# Altium schematic sheet analog.SchDoc
size 381 x 241 mm; SheetNumber: 8; SheetTotal: 13
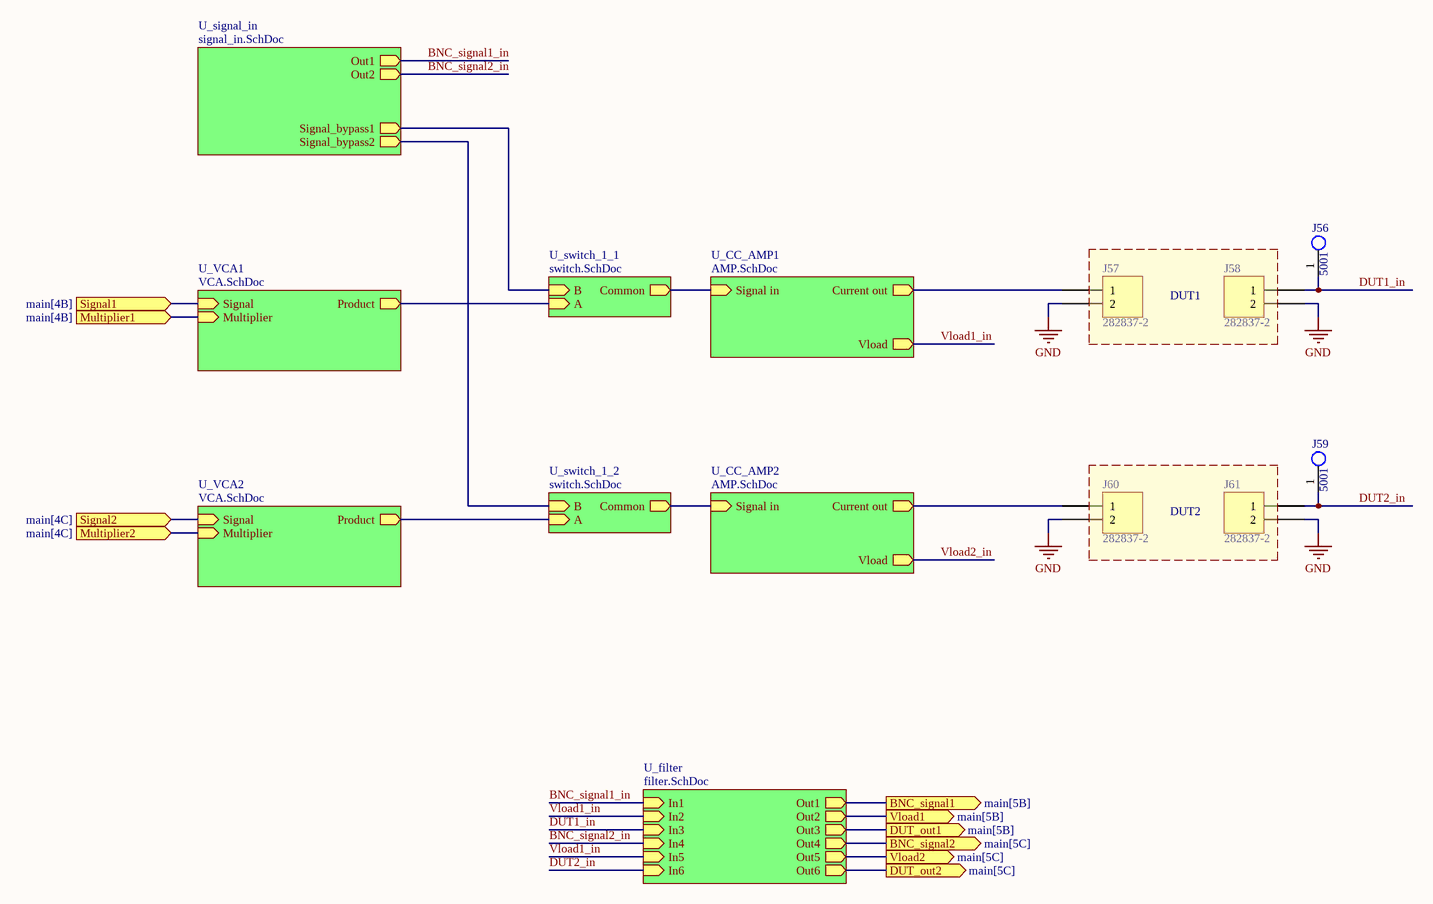
[diagram p0: analog.SchDoc]

## Parts
J56  5001  [FP-5001-MFG]
J57  282837-2  [TE 282837-2]
J58  282837-2  [TE 282837-2]
J59  5001  [FP-5001-MFG]
J60  282837-2  [TE 282837-2]
J61  282837-2  [TE 282837-2]

## Blocks framed on the sheet
DUT1: J57 J58
DUT2: J60 J61

## Sub-sheets
U_CC_AMP1 = AMP.SchDoc: Current out (out), Vload (out), Signal in (in)
U_CC_AMP2 = AMP.SchDoc: Current out (out), Vload (out), Signal in (in)
U_filter = filter.SchDoc: Out3 (out), In3 (in), Out1 (out), In1 (in), Out2 (out), In2 (in), Out4 (out), In4 (in), Out5 (out), In5 (in), Out6 (out), In6 (in)
U_signal_in = signal_in.SchDoc: Out1 (out), Signal_bypass1 (out), Out2 (out), Signal_bypass2 (out)
U_switch_1_1 = switch.SchDoc: B (in), A (in), Common (out)
U_switch_1_2 = switch.SchDoc: B (in), A (in), Common (out)
U_VCA1 = VCA.SchDoc: Product (out), Signal (in), Multiplier (in)
U_VCA2 = VCA.SchDoc: Product (out), Signal (in), Multiplier (in)

## Ports
BNC_signal1 (out, see main[5B]), BNC_signal2 (out, see main[5C]), DUT_out1 (out, see main[5B]), DUT_out2 (out, see main[5C]), Multiplier1 (in, see main[4B]), Multiplier2 (in, see main[4C]), Signal1 (in, see main[4B]), Signal2 (in, see main[4C]), Vload1 (out, see main[5B]), Vload2 (out, see main[5C])

## Nets
GND: J57.2 J58.2 J60.2 J61.2
BNC_signal1: port BNC_signal1, sheet U_filter/Out1
BNC_signal1_in: sheet U_filter/In1, sheet U_signal_in/Out1
BNC_signal2: port BNC_signal2, sheet U_filter/Out4
BNC_signal2_in: sheet U_filter/In4, sheet U_signal_in/Out2
DUT1_in: J56.1 J58.1 ; sheet U_filter/In3
DUT2_in: J59.1 J61.1 ; sheet U_filter/In6
DUT_out1: port DUT_out1, sheet U_filter/Out3
DUT_out2: port DUT_out2, sheet U_filter/Out6
Multiplier1: port Multiplier1, sheet U_VCA1/Multiplier
Multiplier2: port Multiplier2, sheet U_VCA2/Multiplier
Signal1: port Signal1, sheet U_VCA1/Signal
Signal2: port Signal2, sheet U_VCA2/Signal
Vload1: port Vload1, sheet U_filter/Out2
Vload1_in: sheet U_CC_AMP1/Vload, sheet U_filter/In2, sheet U_filter/In5
Vload2: port Vload2, sheet U_filter/Out5
Vload2_in: sheet U_CC_AMP2/Vload
NetJ57_1: J57.1 ; sheet U_CC_AMP1/Current out
NetJ60_1: J60.1 ; sheet U_CC_AMP2/Current out
(unnamed): sheet U_CC_AMP1/Signal in, sheet U_switch_1_1/Common
(unnamed): sheet U_VCA1/Product, sheet U_switch_1_1/A
(unnamed): sheet U_CC_AMP2/Signal in, sheet U_switch_1_2/Common
(unnamed): sheet U_VCA2/Product, sheet U_switch_1_2/A
(unnamed): sheet U_switch_1_1/B, sheet U_signal_in/Signal_bypass1
(unnamed): sheet U_switch_1_2/B, sheet U_signal_in/Signal_bypass2

## Library data of the parts
J56 J59 = CMP-2000-05181-2: PC TEST POINT MINIATURE BLACK; Body Material: Bronze; Plating: Silver; Inside Diameter: 1.27mm; Hole Diameter: 1.6mm; Number of Ports: 1; Outside Diameter: 2.54mm; Insulation: Insulated; Insulation Material: Nylon; Mount: Through Hole; RoHS Compliant: Yes; Series: THM; Height: 0.3inch; Termination: Through Hole; Material: Nylon; Packaging: Bulk; Contact Material: Bronze; REACH SVHC: No SVHC; Contact Plating: Silver; Orientation: Straight; Lead Free: Lead Free; Package Quantity: 100; Length: 7.62mm; Flammability Rating: UL94 V-0; Number of Contacts: 1; Diameter: 2.54mm; Housing Color: Black; Color: Black
J57 J58 J60 J61 = 282837-2: TERM BLK 2P SIDE ENT 5.08MM PCB; Manufacturer: TE Connectivity AMP Connectors; Current: 13.5 A; Mating Orientation: Horizontal with Board; Number of Levels: 1; Pitch: 0.200" (5.08mm); Positions Per Level: 2; Voltage: 300 V; Wire Gauge: 16-28 AWG; Wire Termination: Screw - Rising Cage Clamp; Part Number: 282837-2; Color: Green; ComponentLink1Description: Datasheet; ComponentLink1URL: https://www.te.com/commerce/DocumentDelivery/DDEController?Action=srchrtrv&DocNm=282837&DocType=Customer+Drawing&DocLang=English; ComponentLink2Description: DigiKey Link; ComponentLink2URL: https://www.digikey.com/en/products/detail/te-connectivity-amp-connectors/282837-2/2187973; Features: Interlocking (Side); LastUpdated: 6/21/2022 15:00:23; Lifecycle Status: Active; Minimum Order: 1; Mounting Type: Through Hole; Packaging: Tray; Part Status: Active; Price: 0.31; Series: Buchanan; Supplier 1: DigiKey; Supplier Part Number 1: A113320-ND